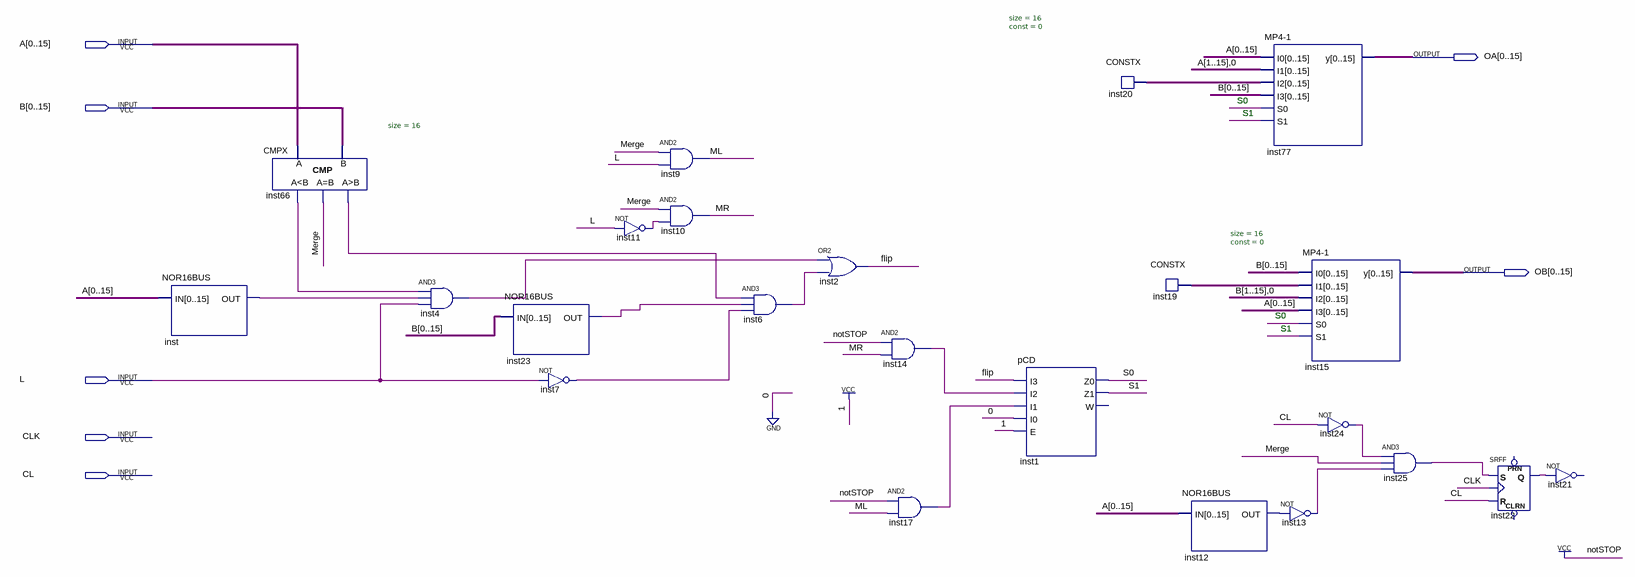
[diagram p0: schematic sheet]
// Quartus schematic Brain.bdf as structural Verilog: 23 symbols, 7 pins
module Brain (
  input  [0:15] A,
  input  [0:15] B,
  input  L,
  input  CLK,
  input  CL,
  output [0:15] OA,
  output [0:15] OB
);

  wire flip, inst4_out, inst6_out, inst7_out, inst11_out, inst12_out, inst13_out, inst14_out, inst17_out,
       inst22_q, inst23_out, inst24_out, inst25_out, inst66_gr, inst66_ls, inst_out, Merge, ML, MR, S0, S1;
  wire [15:0] inst19_data, inst20_data;

  NOR16BUS inst (.IN(A), .OUT(inst_out));
  CMPX #(.size(16)) inst66 (.A(A), .B(B), .ls(inst66_ls), .eq(Merge), .gr(inst66_gr));
  and inst4 (inst4_out, inst66_ls, inst_out, L);
  NOR16BUS inst23 (.IN(B), .OUT(inst23_out));
  not inst7 (inst7_out, L);
  not inst11 (inst11_out, L);
  and inst9 (ML, Merge, L);
  and inst10 (MR, Merge, inst11_out);
  and inst6 (inst6_out, inst66_gr, inst23_out, inst7_out);
  or inst2 (flip, inst4_out, inst6_out);
  and inst14 (inst14_out, 1'b1, MR);
  and inst17 (inst17_out, 1'b1, ML);
  pCD inst1 (.I3(flip), .I2(inst14_out), .I1(inst17_out), .I0(1'b0), .E(1'b1), .Z0(S0), .Z1(S1));  // open: W
  CONSTX #(.size(16), .\const (0)) inst20 (.data(inst20_data));
  CONSTX #(.size(16), .\const (0)) inst19 (.data(inst19_data));
  NOR16BUS inst12 (.IN(A), .OUT(inst12_out));
  \MP4-1  inst77 (.I0(A), .I1({A[1:15], 1'b0}), .I2(inst20_data), .I3(B), .S0(S0), .S1(S1), .y(OA));
  \MP4-1  inst15 (.I0(B), .I1(inst19_data), .I2({B[1:15], 1'b0}), .I3(A), .S0(S0), .S1(S1), .y(OB));
  not inst24 (inst24_out, CL);
  not inst13 (inst13_out, inst12_out);
  and inst25 (inst25_out, inst24_out, Merge, inst13_out);
  SRFF inst22 (.S(inst25_out), .R(CL), .CLK(CLK), .Q(inst22_q));  // open: PRN, CLRN
  // NOT inst21 has open pins: IN=inst22_q, OUT=open

  // Notes on the sheet:
  //   S0
  //   S1
  //   S0
  //   S1
endmodule
